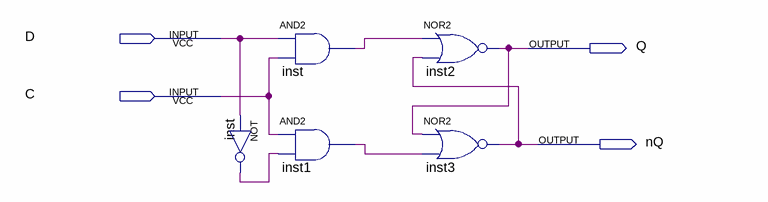
[diagram p0: schematic sheet]
// Quartus schematic D.bdf as structural Verilog: 5 symbols, 4 pins
module D (
  input  D,
  input  C,
  output Q,
  output nQ
);

  wire inst1_out, inst_out, inst_out_2;

  not inst (inst_out_2, D);
  and inst_dup2 (inst_out, D, C);
  and inst1 (inst1_out, C, inst_out_2);
  nor inst2 (Q, inst_out, nQ);
  nor inst3 (nQ, Q, inst1_out);
endmodule
